# EasyEDA schematic SCH_breakout_2024-04-23.json
TITLE: Sheet_1; REV: 1.0; Date: 2024-04-23; Sheet: 1/1; Drawn By: wizardcatz123; Company: Your Company
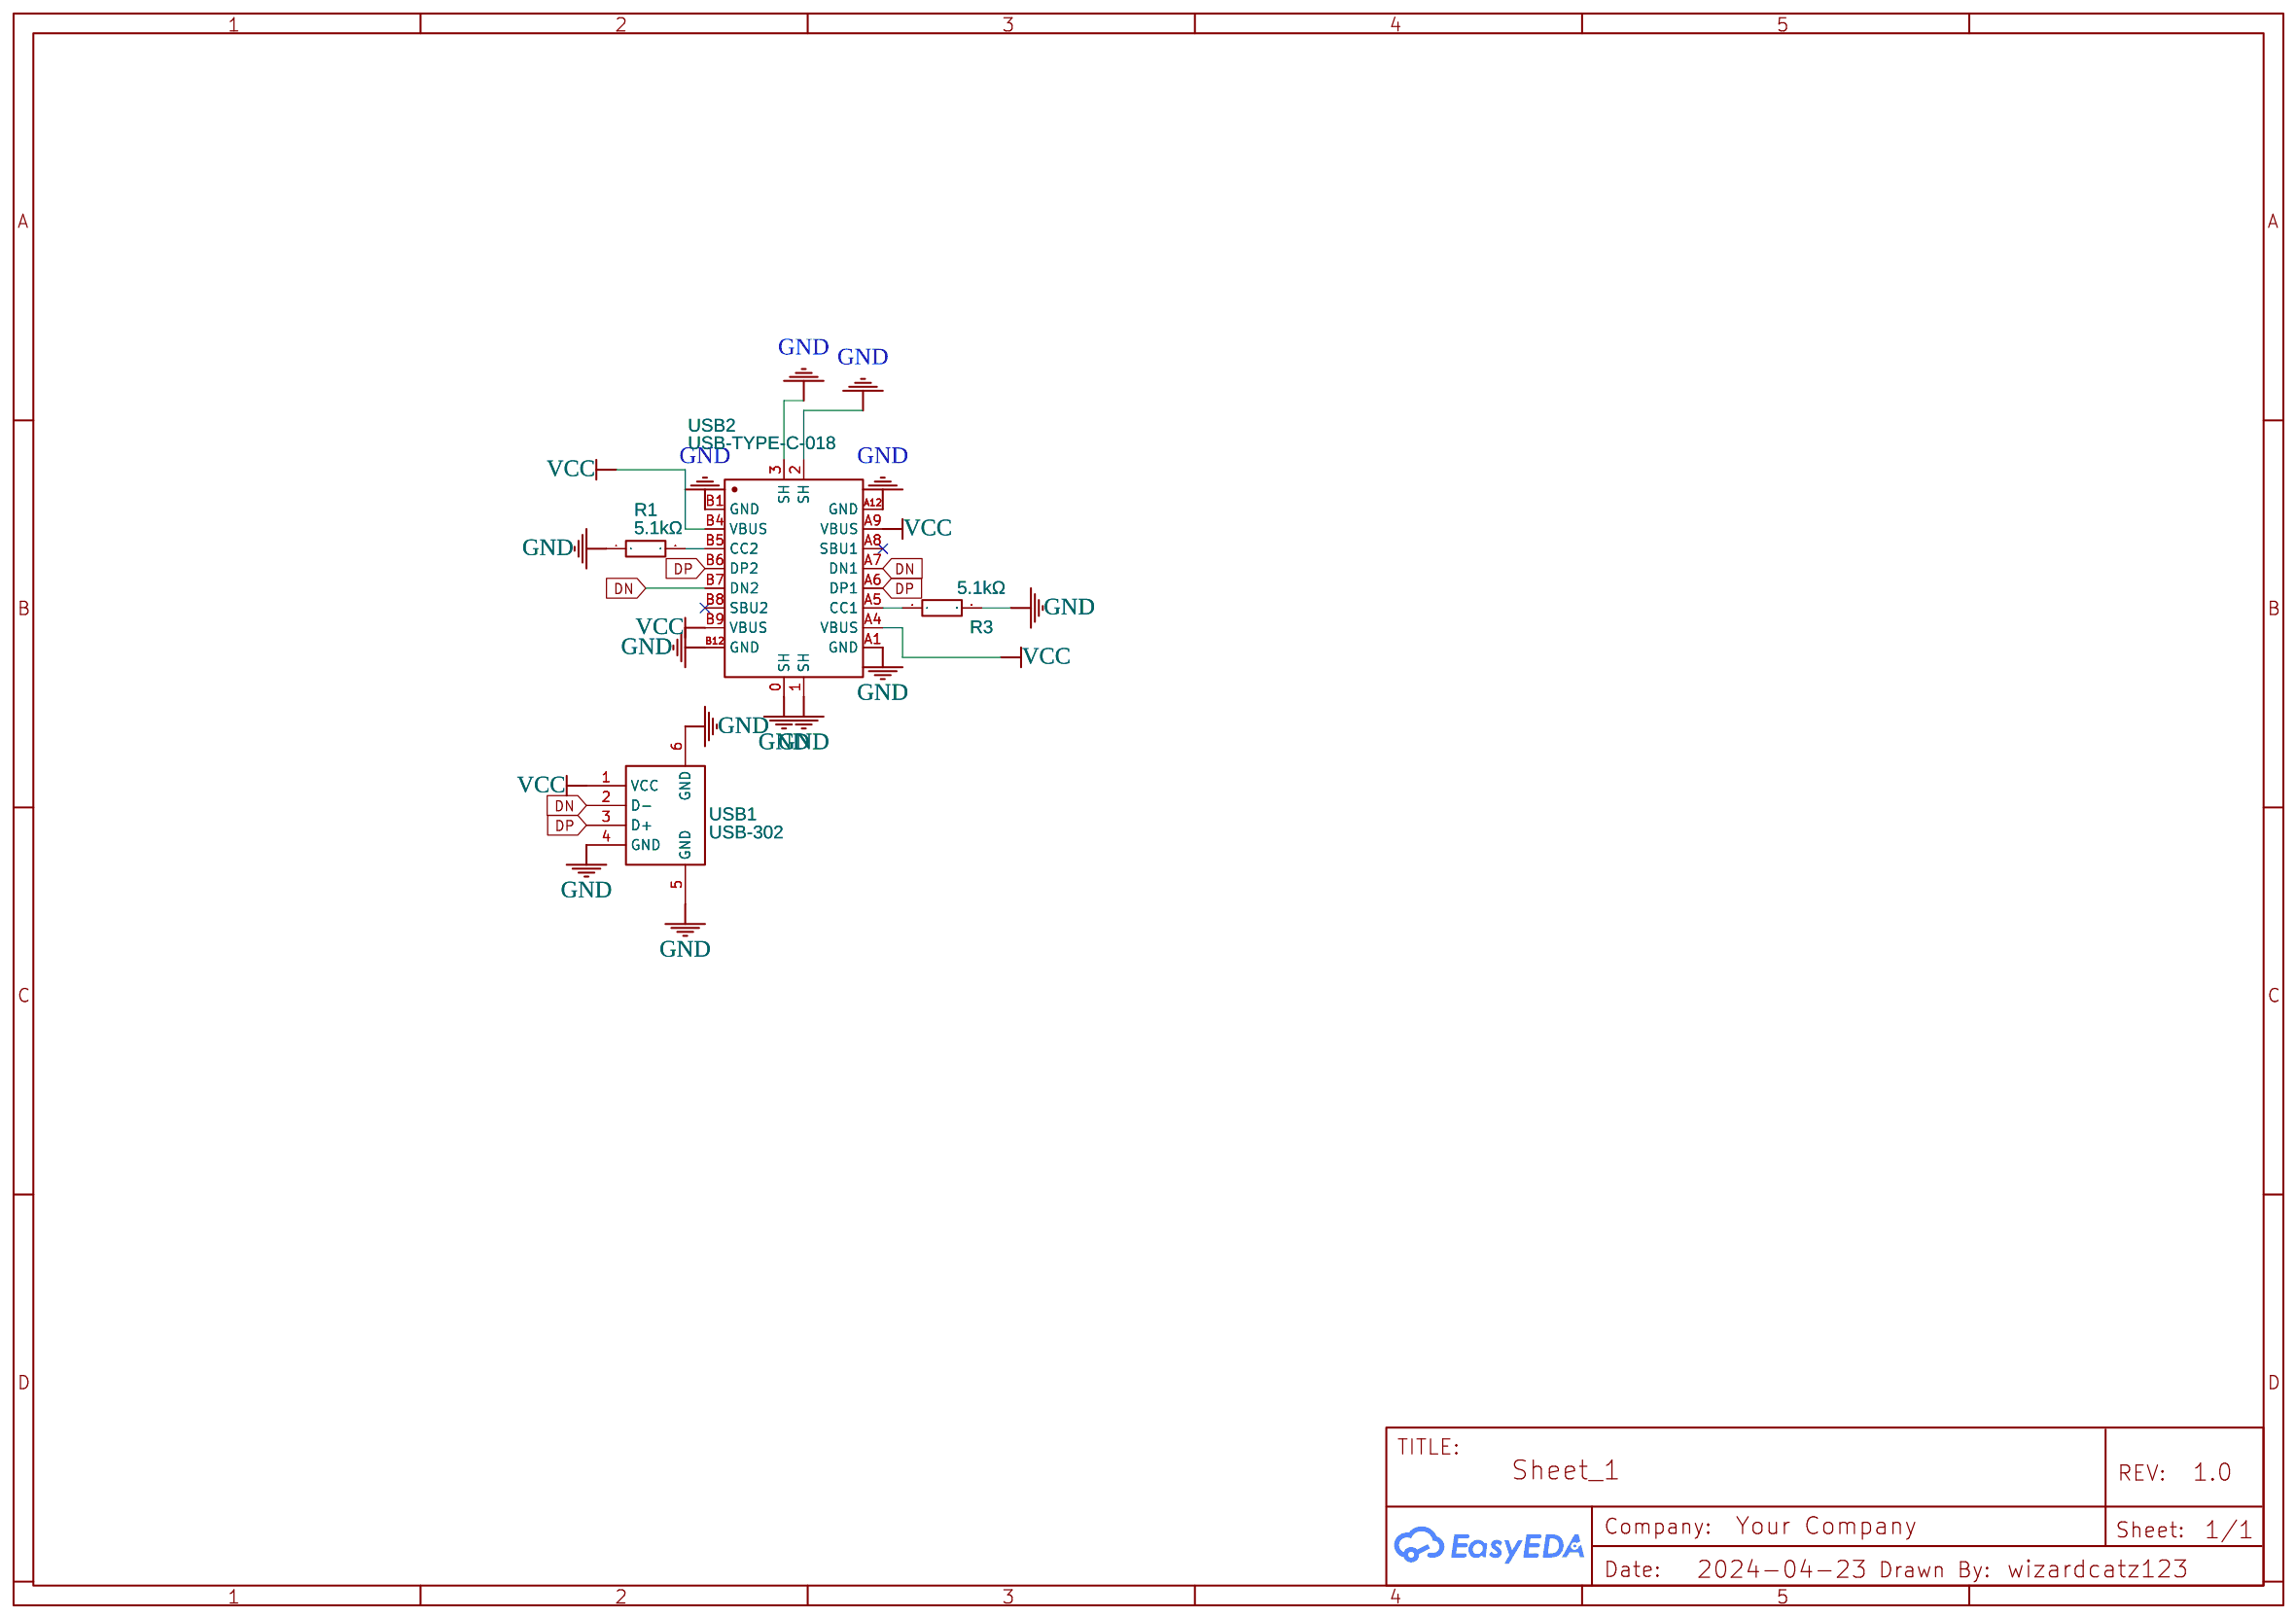
[diagram p0: schematic sheet]

## Parts
R1  5.1kΩ  [R0201]
R3  5.1kΩ  [R0201]
USB1  USB-302  [USB-A-TH_USB-302-T]
USB2  USB-TYPE-C-018  [USB-C_SMD-TYPE-C-31-M-12]

## Library data of the parts
R1 R3 = WR02X5101FALV: Contributor: LCSC; Supplier: LCSC; Supplier Part: C305289; Manufacturer: Walsin(华新科); JLCPCB Part Class: Extended Part
USB1 = USB-302: Supplier: LCSC; Manufacturer: SOFNG(硕方); Manufacturer Part: USB-302-T; Supplier Part: C112456; JLCPCB Part Class: Extended Part
USB2 = USB-TYPE-C-018: Contributor: LCSC; Supplier: LCSC; Supplier Part: C2927038; Manufacturer: DEALON(德艺隆)

## Nets
GND: R1.1 R3.2 USB1.4(GND) USB1.5(GND) USB1.6(GND) USB2.0(SH) USB2.1(SH) USB2.2(SH) USB2.3(SH) USB2.A1(GND) USB2.A12(GND) USB2.B1(GND) USB2.B12(GND)
VCC: USB1.1(VCC) USB2.A4(VBUS) USB2.A9(VBUS) USB2.B4(VBUS) USB2.B9(VBUS)
DN: USB1.2(D-) USB2.A7(DN1) USB2.B7(DN2)
DP: USB1.3(D+) USB2.A6(DP1) USB2.B6(DP2)
Net-(R1-2): R1.2 USB2.B5(CC2)
Net-(R3-1): R3.1 USB2.A5(CC1)

Not connected (* = marked no-connect by the designer): USB2 A8(SBU1)* B8(SBU2)*
